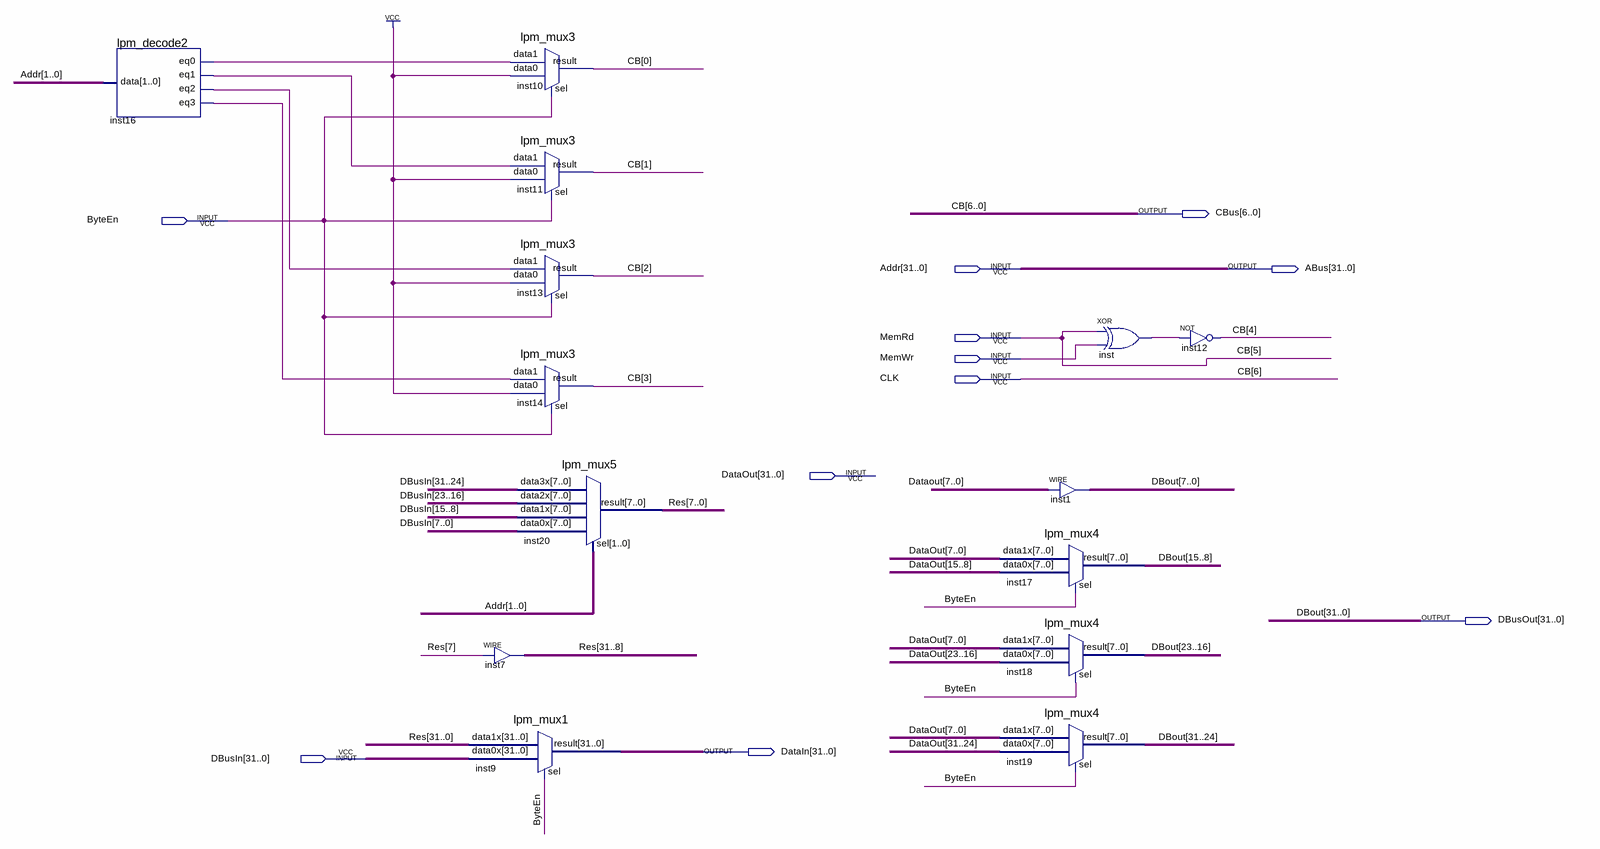
[diagram p0: schematic sheet]
// Quartus schematic DBIU.bdf as structural Verilog: 14 symbols, 11 pins
module DBIU (
  input  ByteEn,
  input  [31:0] Addr,
  input  MemRd,
  input  MemWr,
  input  CLK,
  input  [31:0] DataOut,
  input  [31:0] DBusIn,
  output [6:0] CBus,
  output [31:0] ABus,
  output [31:0] DBusOut,
  output [31:0] DataIn
);

  wire inst16_eq0, inst16_eq1, inst16_eq2, inst16_eq3, inst_out;
  wire [31:0] Res;

  lpm_decode2 inst16 (.data(Addr[1:0]), .eq0(inst16_eq0), .eq1(inst16_eq1), .eq2(inst16_eq2), .eq3(inst16_eq3));
  assign Res[31:8] = {24{Res[7]}};  // WIRE inst7
  lpm_mux1 inst9 (.data1x(Res), .data0x(DBusIn), .sel(ByteEn), .result(DataIn));
  lpm_mux3 inst10 (.data1(inst16_eq0), .data0(1'b1), .sel(ByteEn), .result(CBus[0]));
  lpm_mux3 inst11 (.data1(inst16_eq1), .data0(1'b1), .sel(ByteEn), .result(CBus[1]));
  lpm_mux3 inst13 (.data1(inst16_eq2), .data0(1'b1), .sel(ByteEn), .result(CBus[2]));
  lpm_mux3 inst14 (.data1(inst16_eq3), .data0(1'b1), .sel(ByteEn), .result(CBus[3]));
  lpm_mux5 inst20 (
    .data3x(DBusIn[31:24]), .data2x(DBusIn[23:16]), .data1x(DBusIn[15:8]), .data0x(DBusIn[7:0]),
    .sel(Addr[1:0]), .result(Res[7:0]));
  assign DBusOut[7:0] = DataOut[7:0];  // WIRE inst1
  lpm_mux4 inst17 (.data1x(DataOut[7:0]), .data0x(DataOut[15:8]), .sel(ByteEn), .result(DBusOut[15:8]));
  lpm_mux4 inst18 (.data1x(DataOut[7:0]), .data0x(DataOut[23:16]), .sel(ByteEn), .result(DBusOut[23:16]));
  lpm_mux4 inst19 (.data1x(DataOut[7:0]), .data0x(DataOut[31:24]), .sel(ByteEn), .result(DBusOut[31:24]));
  xor inst (inst_out, MemRd, MemWr);
  not inst12 (CBus[4], inst_out);

  assign ABus = Addr;
  assign CBus[6:5] = {CLK, MemRd};

  // Other names for the same wires on the sheet: CB[6:0] = {CLK, MemRd, CBus[4:0]}; DBout[31:0] = DBusOut
endmodule
